# EAGLE design lpc1102_test (EAGLE 7.3.0)
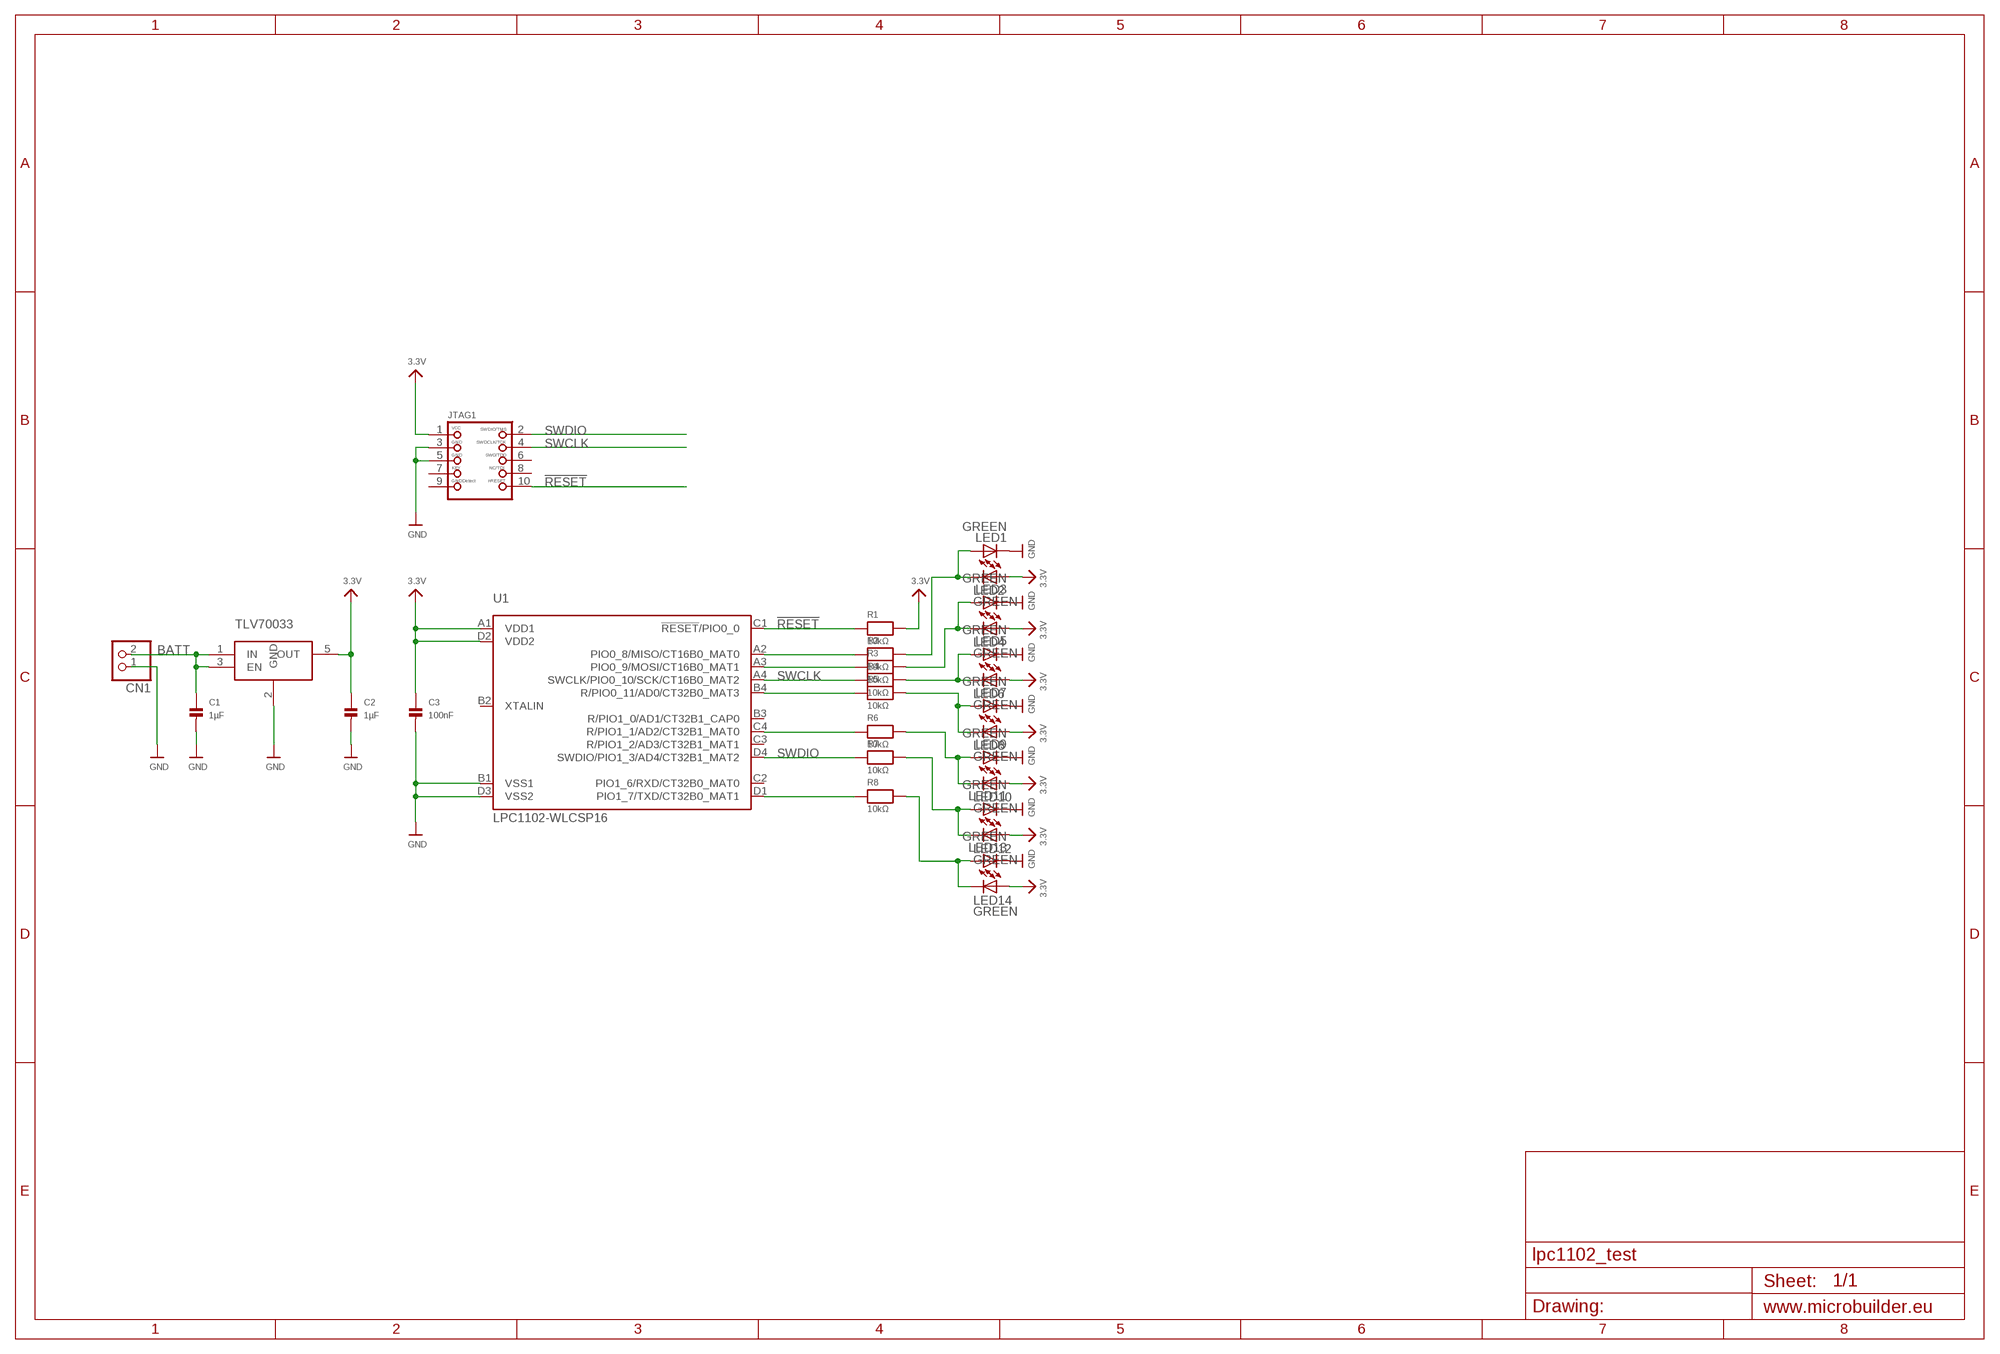
[diagram p0: schematic, sheet 1]

## Parts
C1  1µF  CAP_CERAMIC_0402  [_0402]
C2  1µF  CAP_CERAMIC_0402  [_0402]
C3  100nF  CAP_CERAMIC_0402  [_0402]
CN1  JST_2PIN  [JSTPH2]
JTAG1  JTAG-CORTEXM3SMT  [2X05_1.27MM_SMT]
LED1  GREEN  LEDCHIPLED_0603  [CHIPLED_0603]
LED2  GREEN  LEDCHIPLED_0603  [CHIPLED_0603]
LED3  GREEN  LEDCHIPLED_0603  [CHIPLED_0603]
LED4  GREEN  LEDCHIPLED_0603  [CHIPLED_0603]
LED5  GREEN  LEDCHIPLED_0603  [CHIPLED_0603]
LED6  GREEN  LEDCHIPLED_0603  [CHIPLED_0603]
LED7  GREEN  LEDCHIPLED_0603  [CHIPLED_0603]
LED8  GREEN  LEDCHIPLED_0603  [CHIPLED_0603]
LED9  GREEN  LEDCHIPLED_0603  [CHIPLED_0603]
LED10  GREEN  LEDCHIPLED_0603  [CHIPLED_0603]
LED11  GREEN  LEDCHIPLED_0603  [CHIPLED_0603]
LED12  GREEN  LEDCHIPLED_0603  [CHIPLED_0603]
LED13  GREEN  LEDCHIPLED_0603  [CHIPLED_0603]
LED14  GREEN  LEDCHIPLED_0603  [CHIPLED_0603]
R1  10kΩ  RESISTOR_0201  [_0201]
R2  10kΩ  RESISTOR_0201  [_0201]
R3  10kΩ  RESISTOR_0201  [_0201]
R4  10kΩ  RESISTOR_0201  [_0201]
R5  10kΩ  RESISTOR_0201  [_0201]
R6  10kΩ  RESISTOR_0201  [_0201]
R7  10kΩ  RESISTOR_0201  [_0201]
R8  10kΩ  RESISTOR_0201  [_0201]
U1  LPC1102-WLCSP16  [WLCSP16]
U2  TLV70033DCK  TLV700DCK  [SC70-5L]

## Nets
3.3V: C2.1 C3.1 JTAG1.1 LED2.A LED4.A LED6.A LED8.A LED10.A LED12.A LED14.A R1.2 U1.A1(VDD1) U1.D2(VDD2) U2.5(OUT)
!RESET: JTAG1.10 R1.1 U1.C1(!RESET!/PIO0_0)
BATT: C1.1 CN1.2 U2.1(IN) U2.3(EN)
GND: C1.2 C2.2 C3.2 CN1.1 JTAG1.3 JTAG1.5 LED1.C LED3.C LED5.C LED7.C LED9.C LED11.C LED13.C U1.B1(VSS1) U1.D3(VSS2) U2.2(GND)
N$2: R8.1 U1.D1(PIO1_7/TXD/CT32B0_MAT1)
N$3: LED1.A LED2.C R2.2
N$4: R6.1 U1.C4(R/PIO1_1/AD2/CT32B1_MAT0)
N$5: R5.1 U1.B4(R/PIO0_11/AD0/CT32B0_MAT3)
N$7: R3.1 U1.A3(PIO0_9/MOSI/CT16B0_MAT1)
N$8: R2.1 U1.A2(PIO0_8/MISO/CT16B0_MAT0)
N$22: LED3.A LED4.C R3.2
N$23: LED5.A LED6.C R4.2
N$24: LED7.A LED8.C R5.2
N$25: LED9.A LED10.C R6.2
N$30: LED11.A LED12.C R7.2
N$31: LED13.A LED14.C R8.2
SWCLK: JTAG1.4 R4.1 U1.A4(SWCLK/PIO0_10/SCK/CT16B0_MAT2)
SWDIO: JTAG1.2 R7.1 U1.D4(SWDIO/PIO1_3/AD4/CT32B1_MAT2)
Unconnected: JTAG1.6 JTAG1.7 JTAG1.8 JTAG1.9 U1.B2(XTALIN) U1.B3(R/PIO1_0/AD1/CT32B1_CAP0) U1.C2(PIO1_6/RXD/CT32B0_MAT0) U1.C3(R/PIO1_2/AD3/CT32B1_MAT1)

## Notes on the sheet
- TLV70033

## Library data of the parts
C1-C3 = microbuilder_v3:CAP_CERAMIC: Ceramic Capacitors 0402 - 0402 Surface Mount Capacitors 16pF 50V 5% [Digikey: 445-4899-2-ND] 18pF 50V 5% [Digikey: 490-1281-2-ND] 22pF 50V 5% [Digikey: 490-1283-2-ND] 68pF 50V 5% [Digikey: 490-1289-2-ND] 0.1uF 10V 10% [Digikey: 490-1318-2-ND] 1.0uF 6.3V 10% [Digikey: 490-1320-2-ND] 0603 - 0603 Surface Mount Capacitors 16 pF 50V 5% [Digikey: 445-5051-2-ND] 22 pF 50V [Digikey: PCC220ACVTR-ND] 33 pF 50V 5% [Digikey: 490-1415-1-ND] 56pF 50V 5% [Digikey: 490-1421-1-ND] 220pF 50V 5% [Digikey: 445-1285-1-ND] 680 pF 50V 2200 pF 50V 5% C0G [Digikey: 445-1297-1-ND] 5600 pF 100V 5% X7R [Digikey: 478-3711-1-ND] 0.1 µF 25V 10% [Digikey: PCC2277TR-ND] 0.22 µF 16V 10% X7R [Digikey: 445-1318-1-ND] 1.0 µF 25V 10% [Digikey: 445-5146-2-ND] 0603 - RF Specific 3pF 250V +/-0.1pF RF [Digikey: 712-1347-1-ND] 18 pF 250V 5% [Digikey: 478-3505-1-ND or 712-1322-1-ND] 56 pF 250V 5% C0G RF [Digikey: 490-4867-1-ND] 68 pF 250V RF [Digikey: 490-4868-1-ND] 0805 - 0805 Surface Mount Capacitors 220 pF 250V 2% RF Ceramic Capacitor [Digikey: 712-1398-1-ND] 1000 pF 50V 2% NP0 Ceramic Capacitor [Digikey: 478-3760-1-ND] 0.1 µF 25V 10% Ceramic Capacitor [Digikey: PCC1828TR-ND] 1.0 µF 16V 10% Ceramic Capacitor[Digikey: 490-1691-2-ND] 10.0 µF 10V 10% Ceramic Capacitor[Digikey: 709-1228-1-ND] 10.0 uF 16V 10% Ceramic Capacitor [Digikey: 478-5165-2-ND] 47 uF 6.3V 20% Ceramic Capacitor [Digikey: 587-1779-1-ND or 399-5506-1-ND] 1206 - 1206 Surface Mount Capacitors 47uF 10V 20% Ceramic Capacitor [Digikey: 490-5528-1-ND or 399-5508-1-ND or 445-6010-1-ND] 100uF 6.3V -20%, +80% Y5V Ceramic Capacitor (Digikey: 490-4512-1-ND, Mouser: 81-GRM31CF50J107ZE1L)
CN1 = microbuilder:JST_2PIN: JST 2-Pin Right-Angle Connector PH-Series - 4UConnector: 17311 SH-Series - 4UConnector: 07278
JTAG1 = microbuilder_v3:JTAG-CORTEXM3: Serial Wire (SW-DP) Connector This standard 0.05" 10-pin connector is for use with the Cortex M0/M3's native SWD (serial wire debugger) interface (SW-DP). Some boards support a 20-pin combined JTAG+SWD connector (SWJ-DP), such as the LPC1700 family, but many smaller devices only work with SWD which typically use the smaller 10-pin SW-DP connecter (the LPC1300 family, for example, only supports SWD). 2x05 1.27mm/0.05" Connector: This is the standard SMT connector defined by ARM for all Cortex devices, and should be used in most situations and for forward-compatibility since any new devices coming to market will likely use this connector. MOLEX 10 Pin 0.1" Connector: This 0.1" 10 pin connector has the same pin layout as the standard 0.05" connector, but is easier to work with if you are using standard jumper wires or custom cables to connect your SWD hardware. MOLEX 20 Pin 0.1" Connector: This 0.1" 20 pin connector is the same model used for ARM7/ARM9 JTAG debuggers, but is connected to match the pins on the Segger J-Link for ARM (which supports both JTAG and SWD debugging). See the following document from ARM for more information on Cortex M3 Debug Connectors: http://infocenter.arm.com/help/topic/com.arm.doc.faqs/attached/13634/cortex_debug_connectors.pdf And the following page for an overview with images of the different connector types: http://www.keil.com/peripherals/coresight/connectors.asp
LED1-LED14 = led:LED: LED OSRAM: - CHIPLED LG R971, LG N971, LY N971, LG Q971, LY Q971, LO R971, LY R971 LH N974, LH R974 LS Q976, LO Q976, LY Q976 LO Q996 - Hyper CHIPLED LW Q18S LB Q993, LB Q99A, LB R99A - SideLED LS A670, LO A670, LY A670, LG A670, LP A670 LB A673, LV A673, LT A673, LW A673 LH A674 LY A675 LS A676, LA A676, LO A676, LY A676, LW A676 LS A679, LY A679, LG A679 - Hyper Micro SIDELED® LS Y876, LA Y876, LO Y876, LY Y876 LT Y87S - SmartLED LW L88C, LW L88S LB L89C, LB L89S, LG L890 LS L89K, LO L89K, LY L89K LS L896, LA L896, LO L896, LY L896 - TOPLED LS T670, LO T670, LY T670, LG T670, LP T670 LSG T670, LSP T670, LSY T670, LOP T670, LYG T670 LG T671, LOG T671, LSG T671 LB T673, LV T673, LT T673, LW T673 LH T674 LS T676, LA T676, LO T676, LY T676, LB T676, LH T676, LSB T676, LW T676 LB T67C, LV T67C, LT T67C, LS T67K, LO T67K, LY T67K, LW E67C LS E67B, LA E67B, LO E67B, LY E67B, LB E67C, LV E67C, LT E67C LW T67C LS T679, LY T679, LG T679 LS T770, LO T770, LY T770, LG T770, LP T770 LB T773, LV T773, LT T773, LW T773 LH T774 LS E675, LA E675, LY E675, LS T675 LS T776, LA T776, LO T776, LY T776, LB T776 LHGB T686 LT T68C, LB T68C - Hyper Mini TOPLED® LB M676 - Mini TOPLED Santana® LG M470 LS M47K, LO M47K, LY M47K Source: http://www.osram.convergy.de LUXEON: - LUMILED® LXK2-PW12-R00, LXK2-PW12-S00, LXK2-PW14-U00, LXK2-PW14-V00 LXK2-PM12-R00, LXK2-PM12-S00, LXK2-PM14-U00 LXK2-PE12-Q00, LXK2-PE12-R00, LXK2-PE12-S00, LXK2-PE14-T00, LXK2-PE14-U00 LXK2-PB12-K00, LXK2-PB12-L00, LXK2-PB12-M00, LXK2-PB14-N00, LXK2-PB14-P00, LXK2-PB14-Q00 LXK2-PR12-L00, LXK2-PR12-M00, LXK2-PR14-Q00, LXK2-PR14-R00 LXK2-PD12-Q00, LXK2-PD12-R00, LXK2-PD12-S00 LXK2-PH12-R00, LXK2-PH12-S00 LXK2-PL12-P00, LXK2-PL12-Q00, LXK2-PL12-R00 Source: www.luxeon.com KINGBRIGHT: KA-3528ASYC Source: www.kingbright.com
R1-R8 = microbuilder_v3:RESISTOR: Resistors 0402 - 0402 Surface Mount Package 22 Ohm 1% 1/16W [Digikey: 311-22.0LRTR-ND] 33 Ohm 5% 1/16W 1.0K 5% 1/16W 1.5K 5% 1/16W 2.0K 1% 1/16W 10.0K 1% 1/16W [Digikey: 311-10.0KLRTR-ND] 10.0K 5% 1/16W [Digikey: RMCF0402JT10K0TR-ND] 12.1K 1% 1/16W [Digikey: 311-22.0LRTR-ND] 100.0K 5% 1/16W 0603 - 0603 Surface Mount Package 0 Ohm 1/10 Watt 1% Resistor 15 Ohm 1/10 Watt 1% Resistor 33 Ohm 1/10 Watt 1% Resistor 49.9 Ohm 1/10 Watt 1% Resistor 100 Ohm 1/10 Watt 1% Resistor 150 Ohm 1/10 Watt 1% Resistor 240 Ohm 1/10 Watt 1% Resistor 390 Ohm 1/10 Watt 1% Resistor 560 Ohm 1/10 Watt 1% Resistor 680 Ohm 1/10 Watt 1% Resistor 750 Ohm 1/10 Watt 1% Resistor 1.0K Ohm 1/10 Watt 1% Resistor 1.5K Ohm 1/10 Watt 1% Resistor 2.0K Ohm 1/10 Watt 1% Resistor 2.2K Ohm 1/10 Watt 1% Resistor 3.3K Ohm 1/10 Watt 1% Resistor 4.7K Ohm 1/10 Watt 1% Resistor 10.0K Ohm 1/10 Watt 1% Resistor 12.0K Ohm 1/10 Watt 1% Resistor 12.1K Ohm 1/10 Watt 1% Resistor 20.0K Ohm 1/10 Watt 1% Resistor 33.0K Ohm 1/10 Watt 1% Resistor 100.0K Ohm 1/10 Watt 1% Resistor 0805 - 0805 Surface Mount Package 0 Ohm 1/8 Watt 1% Resistor 33 Ohm 1/8 Watt 1% Resistor 100 Ohm 1/8 Watt 1% Resistor 150 Ohm 1/8 Watt 1% Resistor 200 Ohm 1/8 Watt 1% Resistor 240 Ohm 1/8 Watt 1% Resistor 330 Ohm 1/8 Watt 1% Resistor 390 Ohm 1/8 Watt 1% Resistor 470 Ohm 1/8 Watt 1% Resistor 1.0K Ohm 1/8 Watt 1% Resistor 1.5K Ohm 1/8 Watt 1% Resistor 2.0K Ohm 1/8 Watt 1% Resistor 4.7K Ohm 1/8 Watt 1% Resistor 5.1K Ohm 1/8 Watt 1% Resistor 5.6K Ohm 1/8 Watt 1% Resistor 10.0K Ohm 1/8 Watt 1% Resistor 22.0K Ohm 1/8 Watt 1% Resistor 33.0K Ohm 1/8 Watt 1% Resistor 100K Ohm 1/8 Watt 1% Resistor 1206 - 1206 Surface Mount Package 2012 - 2010 Surface Mount Package 0.11 Ohm 1/2 Watt 1% Resistor - Digikey: RHM.11UCT-ND
U1 = microbuilder_v2:LPC1102-WLCSP16: NXP Semiconductors LPC1102 microcontroller <http://ics.nxp.com/products/lpc1000/lpc11xx/lpc1102/> ARM 32-bit Cortex-M0 Microcontroller with MPU CPU clock up to 50MHz 32KByte on-chip Flash ROM with In-System Programming (ISP) and In-Application Programming (IAP) via On-Chip Bootloader 8KByte SRAM Nested Vectored Interrupt Controller SPI controller UART with full Modem Interface and RS485 Support 4 Timers with 4 capture channels and 13 output channels Watchdog (WDT) Sytem tick timer 10-bit ADC with 5 channels Power Management Unit (PMU) Brownout detection 12MHz internal RC oscillator Serial Wire Debug/Trace port
U2 = tlv700:TLV700

## Board
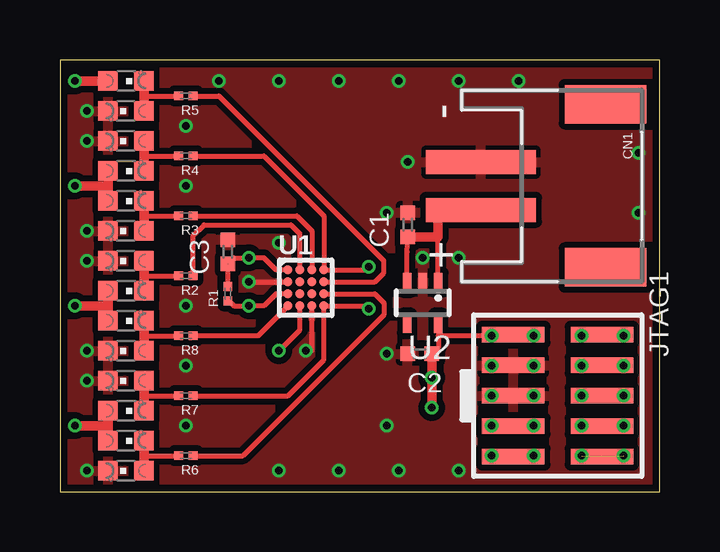
[diagram p1: board, top side]
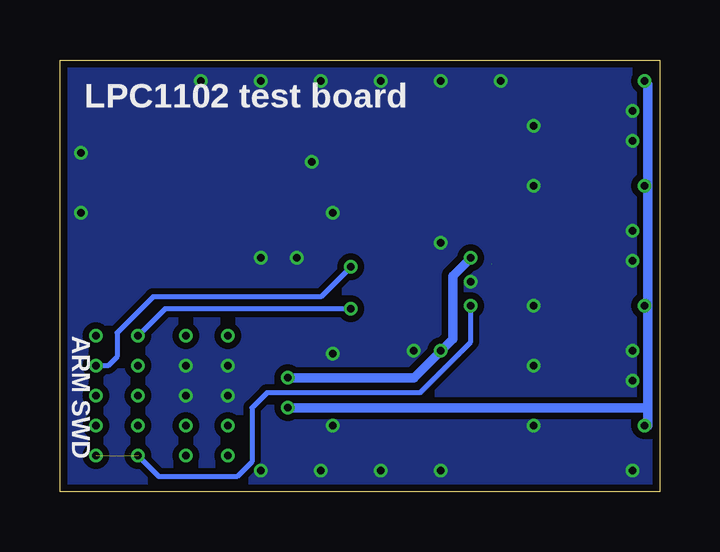
[diagram p2: board, bottom side, seen from below]

Size 25 x 18 mm. Coordinates in mm from the lower left corner, seen from the top.
Outline: 0,0 25,0 25,18 0,18 0,0
Copper layers (1*16): Top 0.035mm / dielectric 1.5mm / Bottom 0.035mm
Design rules "default": minimum track width 0.125mm, minimum drill 0.2mm, track to track 0.125mm, track to pad 0.125mm, pad to pad 0.125mm, via to via 0.125mm, smd to smd 0.125mm, copper to edge 0.3mm, drill to drill 0.2mm, minimum pad ring 0.2mm, minimum via ring 0.125mm, stop-mask expansion 0.075mm, vias tented up to drill 0mil, thermal gap 0.2mm

### Footprints (pad centres in the part's own frame; a part is rotated, then mirrored left to right if it is on the bottom)
_0402 = smd 0.6 x 0.6: 1 -0.508,0; 2 0.508,0
JSTPH2 = smd 1 x 4.6: 1 -1,-3.7; 2 1,-3.7 | smd 1.6 x 3.4: NC1 -3.4,1.5; NC2 3.4,1.5
2X05_1.27MM_SMT = smd 0.65 x 2.6: 1 -2.54,-1.85; 2 -2.54,1.85; 3 -1.27,-1.85; 4 -1.27,1.85; 5 0,-1.85; 6 0,1.85; 7 1.27,-1.85; 8 1.27,1.85; 9 2.54,-1.85; 10 2.54,1.85
CHIPLED_0603 = smd 0.8 x 0.8: A 0,-0.75; C 0,0.75
_0201 = smd 0.36 x 0.36: 1 -0.305,0; 2 0.305,0
WLCSP16 = smd 0.35 x 0.35: A1 -0.75,0.75; A2 -0.25,0.75; A3 0.25,0.75; A4 0.75,0.75; B1 -0.75,0.25; B2 -0.25,0.25; B3 0.25,0.25; B4 0.75,0.25; C1 -0.75,-0.25; C2 -0.25,-0.25; C3 0.25,-0.25; C4 0.75,-0.25; D1 -0.75,-0.75; D2 -0.25,-0.75; D3 0.25,-0.75; D4 0.75,-0.75
SC70-5L = smd 0.35 x 0.8: 1 -0.65,-0.85; 2 0,-0.85; 3 0.65,-0.85; 4 0.65,0.85; 5 -0.65,0.85

### Placement (x,y rotation side)
C1  14.5,11.12 90 top
C2  15,5.75 180 top
C3  7,10 90 top
CN1  21.25,12.75 270 top
JTAG1  20.75,4 270 top
LED1  2.75,9.62 90 top
LED2  2.75,8.38 270 top
LED3  2.75,10.88 90 top
LED4  2.75,12.12 270 top
LED5  2.75,14.62 90 top
LED6  2.75,13.38 270 top
LED7  2.75,15.88 90 top
LED8  2.75,17.12 270 top
LED9  2.75,0.88 90 top
LED10  2.75,2.12 270 top
LED11  2.75,4.62 90 top
LED12  2.75,3.38 270 top
LED13  2.75,5.88 90 top
LED14  2.75,7.12 270 top
R1  7,8.25 90 top
R2  5.25,9 180 top
R3  5.25,11.5 180 top
R4  5.25,14 180 top
R5  5.25,16.5 180 top
R6  5.25,1.5 180 top
R7  5.25,4 180 top
R8  5.25,6.5 180 top
U1  10.25,8.5 0 top
U2  15.12,7.88 180 top

### Tracks (layer width: path | path; a pad name or v marks a point on that pad's centre or on a via)
3.3V  (via drill 0.33)  (1 unrouted)
  Top 0.2: v9.12,5.88 10,6.75 U1.D2 | U1.A1 9,9.25 8.5,9.75 v7.88,9.75 7.25,9.75 C3.1 R1.2 | U2.5 15.78,6.5 | 15.78,6.5 15.78,6.02 C2.1 | 15.78,6.5 v18,6.5 v19.75,6.5 18.94,6.5 JTAG1.1
  Top 0.4: LED4.A LED6.A 2,12.75 v0.62,12.75 | LED14.A LED2.A 2,7.75 v0.62,7.75 | LED10.A LED12.A 2,2.75 v0.62,2.75 | v0.62,17.12 LED8.A | C2.1 v15.51,4.76 v15.5,4.75 v15.5,3.5
  Bottom 0.4: v15.5,4.75 10.25,4.75 v9.12,5.88 8.62,6.38 8.62,9 v7.88,9.75 | v0.62,17.12 0.5,17 0.5,12.75 | 0.5,12.75 0.5,7.75 | 0.5,7.75 0.5,3.5 | 0.5,3.5 0.5,2.75 v0.62,2.75 | v0.62,12.75 0.5,12.75 | v0.62,7.75 0.5,7.75 | v15.5,3.5 0.5,3.5
!RESET  (via drill 0.33)  (2 unrouted)
  Top 0.2: U1.C1 9,8.25 8.5,7.75 v7.88,7.75 7.25,7.75 7,8 R1.1
  Bottom 0.2: v7.88,7.75 7.88,6.25 10,4.12 16.38,4.12 17,3.5 17,1.25 17.62,0.62 20.88,0.62 v21.75,1.5
  other vias: 23.5,1.5
BATT
  Top 0.2: U2.3 14.47,9.99 C1.1 | U2.1 15.75,8.75 15.75,10.62
  Top 0.4: C1.1 15.75,10.62 15.75,11.75 CN1.2 18.12,11.75
GND  (via drill 0.33)
  Top 0.2: v10.25,5.88 10.5,5.88 U1.D3 | v7.88,8.75 U1.B1
  other vias: 14.5,13.75 1.12,0.88 1.12,4.62 1.12,5.88 1.12,9.62 1.12,10.88 1.12,14.62 1.12,15.88 18,5.25 19.75,5.25 18,4 19.75,4 9.12,10.38 5.25,7.75 5.25,5.25 5.25,2.75 5.25,12.75 5.25,15.25 13.62,5.75 13.62,11.62 15.12,9.75 13.62,2.75 9.12,0.88 11.62,0.88 14.12,0.88 16.62,0.88 9.12,17.12 6.62,17.12 11.62,17.12 14.12,17.12 16.62,17.12 19.12,17.12 24.12,14.12 24.12,11.62 16.62,9.75
  pour Top (isolate 0.254): 25,0 0,0 0,18 25,18
  pour Bottom (isolate 0.254): 0,0 25,0 25,18 0,18
N$2
  Top 0.2: U1.D1 8.25,6.5 R8.1
N$3
  Top 0.2: 3.5,9 R2.2
  Top 0.4: LED1.A 3.5,9 LED2.C
N$4
  Top 0.2: U1.C4 13.12,8.25 13.5,7.88 13.5,7.38 7.62,1.5 R6.1
N$5
  Top 0.2: U1.B4 13.12,8.75 13.5,9.12 13.5,9.62 6.62,16.5 R5.1
N$7
  Top 0.2: U1.A3 10.5,10.88 9.88,11.5 R3.1
N$8
  Top 0.2: U1.A2 10,10.75 9.62,11.12 6,11.12 5.55,10.68 R2.1
N$14  (via drill 0.33)
  other vias: 18,1.5
N$15  (via drill 0.33)
  other vias: 19.75,1.5
N$16  (via drill 0.33)
  other vias: 19.75,2.75
N$17  (via drill 0.33)
  other vias: 18,2.75
N$22
  Top 0.2: 3.5,11.5 R3.2
  Top 0.4: LED4.C 3.5,11.5 LED3.A
N$23
  Top 0.2: 3.5,14 R4.2
  Top 0.4: LED5.A 3.5,14 LED6.C
N$24
  Top 0.2: 3.5,16.5 R5.2
  Top 0.4: LED8.C 3.5,16.5 LED7.A
N$25
  Top 0.2: 3.5,1.5 R6.2
  Top 0.4: LED10.C 3.5,1.5 LED9.A
N$26  (via drill 0.33)
  other vias: 23.5,2.75
N$27  (via drill 0.33)
  other vias: 21.75,2.75
N$28  (via drill 0.33)
  other vias: 21.75,4
N$29  (via drill 0.33)
  other vias: 23.5,4
N$30
  Top 0.2: 3.5,4 R7.2
  Top 0.4: LED11.A 3.5,4 LED12.C
N$31
  Top 0.2: 3.5,6.5 R8.2
  Top 0.4: LED14.C 3.5,6.5 LED13.A
SWCLK  (via drill 0.33)
  Top 0.2: v12.88,9.38 12.75,9.25 U1.A4 11,11.5 8.5,14 R4.1 | v21.75,5.25 22.58,5.25 JTAG1.4 23.48,5.27 v23.5,5.25
  Bottom 0.2: v12.88,9.38 14.12,8.12 21.12,8.12 22.62,6.62 22.62,5.62 23,5.25 v23.5,5.25
SWDIO  (via drill 0.33)
  Top 0.2: v12.88,7.62 12.75,7.75 U1.D4 11,5.5 9.5,4 R7.1 | v21.75,6.5 22.56,6.5 JTAG1.2 22.64,6.5 v23.5,6.5
  Bottom 0.2: v12.88,7.62 20.62,7.62 v21.75,6.5

### Text on the board
bPlace: LPC1102 test board | ARM SWD